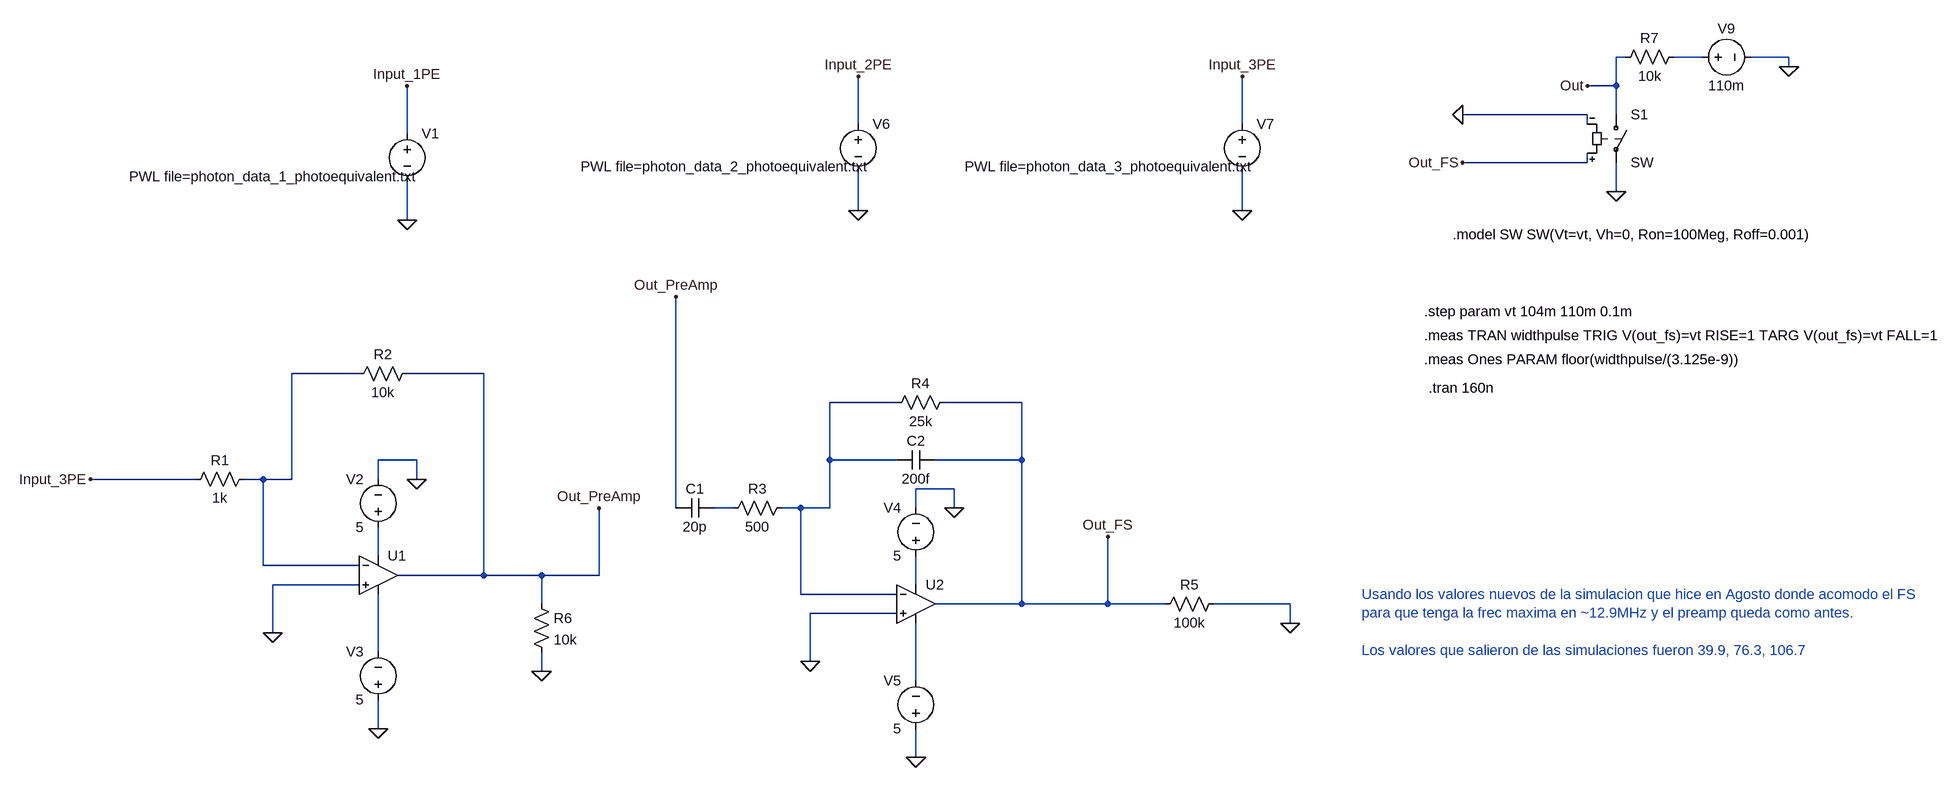
[diagram p0: schematic threshold_calculator.asc]
threshold_calculator.asc, the LTspice schematic file:
Version 4
SHEET 1 2920 852
WIRE 2128 -752 2112 -752
WIRE 2256 -752 2208 -752
WIRE 2400 -752 2336 -752
WIRE 2400 -736 2400 -752
WIRE 2112 -704 2112 -752
WIRE 2112 -704 2064 -704
WIRE 2064 -656 1856 -656
WIRE 2112 -656 2112 -704
WIRE 704 -640 704 -720
WIRE 1344 -640 1344 -720
WIRE 2064 -640 2064 -656
WIRE -48 -624 -48 -704
WIRE 2064 -576 2064 -592
WIRE 2064 -576 1856 -576
WIRE 2112 -528 2112 -576
WIRE 704 -496 704 -560
WIRE 1344 -496 1344 -560
WIRE -48 -480 -48 -544
WIRE -128 -224 -240 -224
WIRE 80 -224 -48 -224
WIRE 768 -176 656 -176
WIRE 976 -176 848 -176
WIRE -32 -80 -96 -80
WIRE 656 -80 656 -176
WIRE 768 -80 656 -80
WIRE 976 -80 976 -176
WIRE 976 -80 832 -80
WIRE -400 -48 -576 -48
WIRE -288 -48 -320 -48
WIRE -240 -48 -240 -224
WIRE -240 -48 -288 -48
WIRE -96 -48 -96 -80
WIRE -32 -48 -32 -80
WIRE 864 -32 800 -32
WIRE 400 0 400 -352
WIRE 496 0 464 0
WIRE 608 0 576 0
WIRE 656 0 656 -80
WIRE 656 0 608 0
WIRE 800 0 800 -32
WIRE 864 0 864 -32
WIRE -96 80 -96 32
WIRE -288 96 -288 -48
WIRE -128 96 -288 96
WIRE 80 112 80 -224
WIRE 80 112 -64 112
WIRE 176 112 80 112
WIRE 272 112 272 0
WIRE 272 112 176 112
WIRE -128 128 -272 128
WIRE 800 128 800 80
WIRE 608 144 608 0
WIRE 768 144 608 144
WIRE 176 160 176 112
WIRE 976 160 976 -80
WIRE 976 160 832 160
WIRE 1120 160 1120 48
WIRE 1120 160 976 160
WIRE 1216 160 1120 160
WIRE 1424 160 1296 160
WIRE 768 176 624 176
WIRE 1424 192 1424 160
WIRE -272 208 -272 128
WIRE -96 240 -96 144
WIRE 624 256 624 176
WIRE 176 272 176 240
WIRE 800 288 800 192
WIRE -96 368 -96 320
WIRE 800 416 800 368
FLAG -96 368 0
FLAG -32 -48 0
FLAG -48 -480 0
FLAG -272 208 0
FLAG 800 416 0
FLAG 864 0 0
FLAG 624 256 0
FLAG 272 0 Out_PreAmp
FLAG 1120 48 Out_FS
FLAG 1424 192 0
FLAG 400 -352 Out_PreAmp
FLAG -48 -704 Input_1PE
FLAG 704 -496 0
FLAG 704 -720 Input_2PE
FLAG -576 -48 Input_3PE
FLAG 176 272 0
FLAG 1344 -496 0
FLAG 1344 -720 Input_3PE
FLAG 2112 -528 0
FLAG 2400 -736 0
FLAG 2064 -704 Out
FLAG 1856 -656 0
FLAG 1856 -576 Out_FS
SYMBOL res -304 -64 R90
WINDOW 0 0 56 VBottom 2
WINDOW 3 32 56 VTop 2
SYMATTR InstName R1
SYMATTR Value 1k
SYMBOL res -32 -240 R90
WINDOW 0 0 56 VBottom 2
WINDOW 3 32 56 VTop 2
SYMATTR InstName R2
SYMATTR Value 10k
SYMBOL voltage -96 48 R180
WINDOW 0 24 96 Left 2
WINDOW 3 24 16 Left 2
WINDOW 123 0 0 Left 0
WINDOW 39 0 0 Left 0
SYMATTR InstName V2
SYMATTR Value 5
SYMBOL voltage -96 336 R180
WINDOW 0 24 96 Left 2
WINDOW 3 24 16 Left 2
WINDOW 123 0 0 Left 0
WINDOW 39 0 0 Left 0
SYMATTR InstName V3
SYMATTR Value 5
SYMBOL OpAmps\\UniversalOpAmp1 -96 112 R0
SYMATTR InstName U1
SYMATTR Value2 Avol=1Meg GBW=100Meg Vos=0
SYMBOL res 592 -16 R90
WINDOW 0 0 56 VBottom 2
WINDOW 3 32 56 VTop 2
SYMATTR InstName R3
SYMATTR Value 500
SYMBOL res 864 -192 R90
WINDOW 0 0 56 VBottom 2
WINDOW 3 32 56 VTop 2
SYMATTR InstName R4
SYMATTR Value 25k
SYMBOL voltage 800 96 R180
WINDOW 0 24 96 Left 2
WINDOW 3 24 16 Left 2
WINDOW 123 0 0 Left 0
WINDOW 39 0 0 Left 0
SYMATTR InstName V4
SYMATTR Value 5
SYMBOL voltage 800 384 R180
WINDOW 0 24 96 Left 2
WINDOW 3 24 16 Left 2
WINDOW 123 0 0 Left 0
WINDOW 39 0 0 Left 0
SYMATTR InstName V5
SYMATTR Value 5
SYMBOL OpAmps\\UniversalOpAmp1 800 160 R0
SYMATTR InstName U2
SYMATTR Value2 Avol=1Meg GBW=800Meg Vos=0
SYMBOL voltage -48 -640 R0
WINDOW 3 -463 87 Left 2
WINDOW 123 0 0 Left 0
WINDOW 39 0 0 Left 0
SYMATTR Value PWL file=photon_data_1_photoequivalent.txt
SYMATTR InstName V1
SYMBOL res 1312 144 R90
WINDOW 0 0 56 VBottom 2
WINDOW 3 32 56 VTop 2
SYMATTR InstName R5
SYMATTR Value 100k
SYMBOL cap 464 -16 R90
WINDOW 0 0 32 VBottom 2
WINDOW 3 32 32 VTop 2
SYMATTR InstName C1
SYMATTR Value 20p
SYMBOL cap 832 -96 R90
WINDOW 0 0 32 VBottom 2
WINDOW 3 32 32 VTop 2
SYMATTR InstName C2
SYMATTR Value 200f
SYMBOL voltage 704 -656 R0
WINDOW 3 -463 87 Left 2
WINDOW 123 0 0 Left 0
WINDOW 39 0 0 Left 0
SYMATTR Value PWL file=photon_data_2_photoequivalent.txt
SYMATTR InstName V6
SYMBOL res 160 144 R0
SYMATTR InstName R6
SYMATTR Value 10k
SYMBOL voltage 1344 -656 R0
WINDOW 3 -463 87 Left 2
WINDOW 123 0 0 Left 0
WINDOW 39 0 0 Left 0
SYMATTR Value PWL file=photon_data_3_photoequivalent.txt
SYMATTR InstName V7
SYMBOL sw 2112 -672 R0
SYMATTR InstName S1
SYMBOL voltage 2240 -752 R270
WINDOW 0 32 56 VTop 2
WINDOW 3 -32 56 VBottom 2
WINDOW 123 0 0 Left 0
WINDOW 39 0 0 Left 0
SYMATTR InstName V9
SYMATTR Value 110m
SYMBOL res 2224 -768 R90
WINDOW 0 0 56 VBottom 2
WINDOW 3 32 56 VTop 2
SYMATTR InstName R7
SYMATTR Value 10k
TEXT 1800 -200 Left 2 !.tran 160n
TEXT 1840 -456 Left 2 !.model SW SW(Vt=vt, Vh=0, Ron=100Meg, Roff=0.001)
TEXT 1792 -328 Left 2 !.step param vt 104m 110m 0.1m
TEXT 1792 -248 Left 2 !.meas Ones PARAM floor(widthpulse/(3.125e-9))
TEXT 1792 -288 Left 2 !.meas TRAN widthpulse TRIG V(out_fs)=vt RISE=1 TARG V(out_fs)=vt FALL=1
TEXT 1688 144 Left 2 ;Usando los valores nuevos de la simulacion que hice en Agosto donde acomodo el FS\npara que tenga la frec maxima en ~12.9MHz y el preamp queda como antes.\n \nLos valores que salieron de las simulaciones fueron 39.9, 76.3, 106.7

The netlist it stands for:
* threshold_calculator.asc
R1 N002 Input_3PE 1k
R2 Out_PreAmp N002 10k
V2 N005 0 5
V3 0 N007 5
XU1 0 N002 N005 N007 Out_PreAmp level1 Avol=1Meg GBW=100Meg Vos=0 En=0 Enk=0 In=0 Ink=0 Rin=500Meg  ; pins In+ In- V+ V- OUT
R3 N003 N004 500
R4 Out_FS N003 25k
V4 N006 0 5
V5 0 N008 5
XU2 0 N003 N006 N008 Out_FS level1 Avol=1Meg GBW=800Meg Vos=0 En=0 Enk=0 In=0 Ink=0 Rin=500Meg  ; pins In+ In- V+ V- OUT
V1 Input_1PE 0 PWL file=photon_data_1_photoequivalent.txt
R5 0 Out_FS 100k
C1 N004 Out_PreAmp 20p
C2 Out_FS N003 200f
V6 Input_2PE 0 PWL file=photon_data_2_photoequivalent.txt
R6 Out_PreAmp 0 10k
V7 Input_3PE 0 PWL file=photon_data_3_photoequivalent.txt
S1 Out 0 Out_FS 0 SW
V9 N001 0 110m
R7 N001 Out 10k
.tran 160n
.model SW SW(Vt=vt, Vh=0, Ron=100Meg, Roff=0.001)
.step param vt 104m 110m 0.1m
.meas Ones PARAM floor(widthpulse/(3.125e-9))
.meas TRAN widthpulse TRIG V(out_fs)=vt RISE=1 TARG V(out_fs)=vt FALL=1
* Usando los valores nuevos de la simulacion que hice en Agosto donde acomodo el FS
* para que tenga la frec maxima en ~12.9MHz y el preamp queda como antes.
* Los valores que salieron de las simulaciones fueron 39.9, 76.3, 106.7
.lib UniversalOpAmp1.lib
.backanno
.end